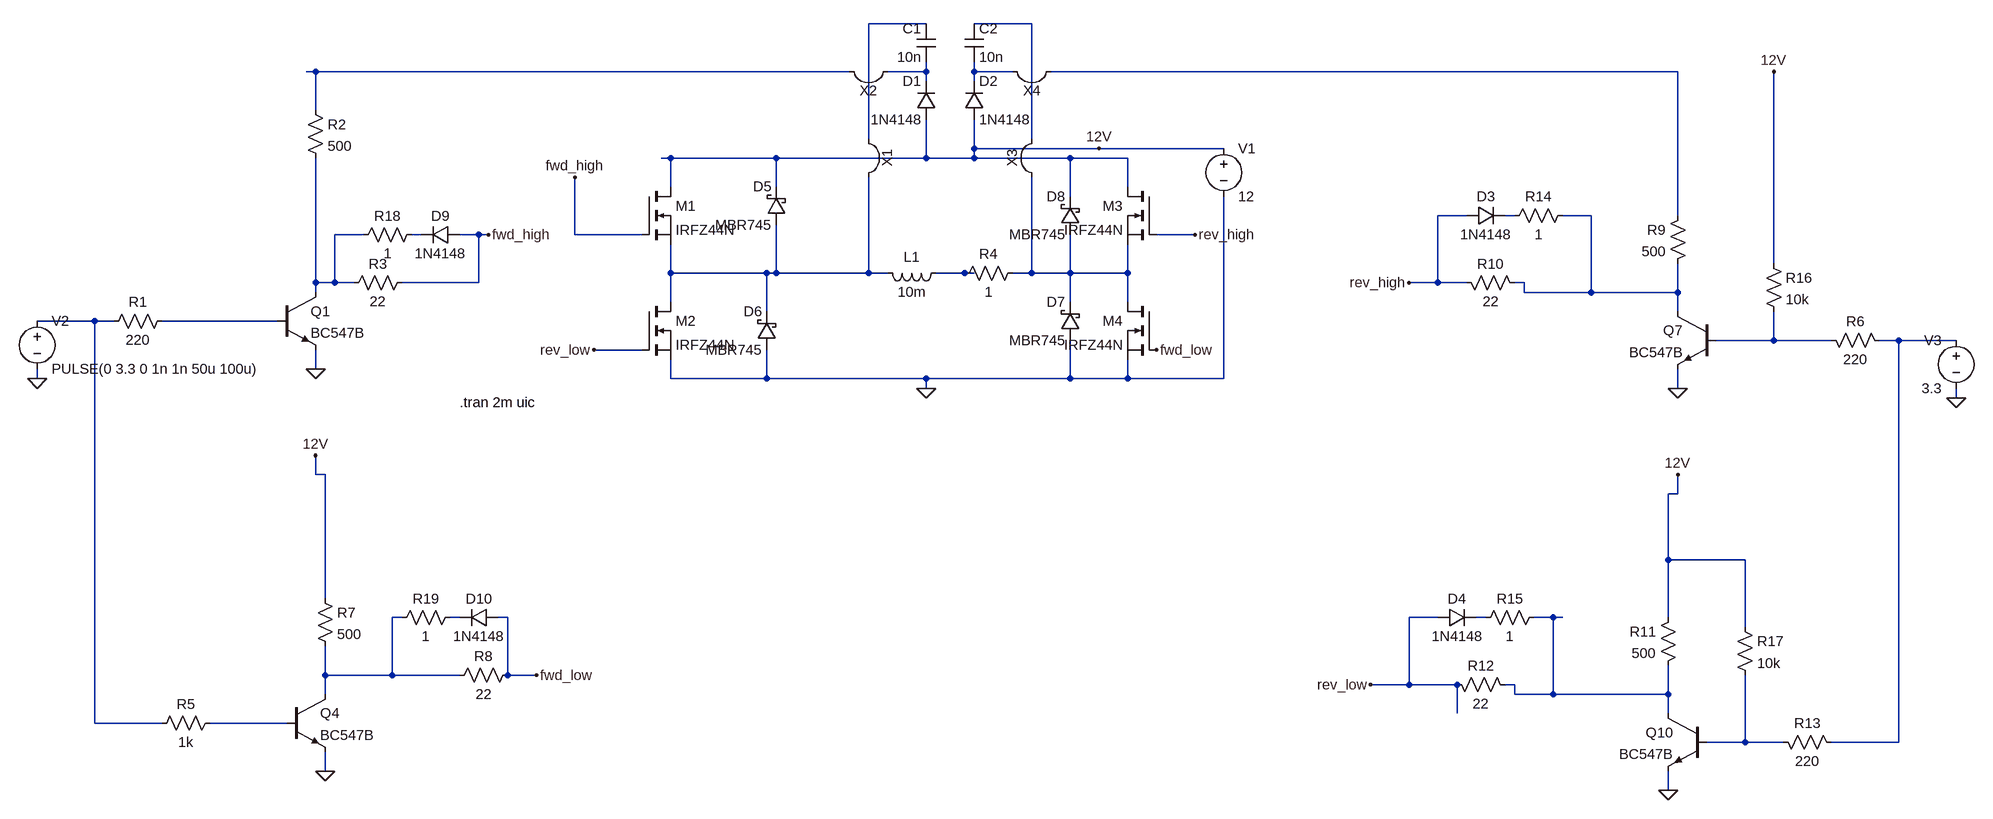
[diagram p0: schematic h-bridge-minimal.asc]
h-bridge-minimal.asc, the LTspice schematic file:
Version 4
SHEET 1 2020 1028
WIRE 224 -272 128 -272
WIRE 400 -272 304 -272
WIRE -832 -192 -848 -192
WIRE 96 -192 -832 -192
WIRE 224 -192 224 -208
WIRE 224 -192 160 -192
WIRE 304 -192 304 -208
WIRE 368 -192 304 -192
WIRE 1520 -192 432 -192
WIRE 224 -176 224 -192
WIRE 304 -176 304 -192
WIRE -832 -128 -832 -192
WIRE 128 -80 128 -272
WIRE 400 -80 400 -272
WIRE 304 -64 304 -112
WIRE 512 -64 304 -64
WIRE 720 -64 512 -64
WIRE -240 -48 -256 -48
WIRE -64 -48 -240 -48
WIRE 224 -48 224 -112
WIRE 224 -48 -64 -48
WIRE 304 -48 304 -64
WIRE 304 -48 224 -48
WIRE 464 -48 304 -48
WIRE 560 -48 464 -48
WIRE -240 0 -240 -48
WIRE -64 0 -64 -48
WIRE 560 0 560 -48
WIRE 464 16 464 -48
WIRE 1168 48 1120 48
WIRE 1248 48 1232 48
WIRE 1376 48 1328 48
WIRE 1520 48 1520 -192
WIRE -752 80 -800 80
WIRE -656 80 -672 80
WIRE -560 80 -592 80
WIRE -544 80 -560 80
WIRE -400 80 -400 -16
WIRE -288 80 -400 80
WIRE 672 80 608 80
WIRE 1680 128 1680 -192
WIRE -240 144 -240 96
WIRE -80 144 -240 144
WIRE -64 144 -64 64
WIRE -64 144 -80 144
WIRE 128 144 128 -16
WIRE 128 144 -64 144
WIRE 160 144 128 144
WIRE 288 144 240 144
WIRE 304 144 288 144
WIRE 400 144 400 -16
WIRE 400 144 368 144
WIRE 464 144 464 80
WIRE 464 144 400 144
WIRE 560 144 560 96
WIRE 560 144 464 144
WIRE -832 160 -832 -48
WIRE -800 160 -800 80
WIRE -800 160 -832 160
WIRE -768 160 -800 160
WIRE -560 160 -560 80
WIRE -560 160 -688 160
WIRE 1120 160 1120 48
WIRE 1120 160 1072 160
WIRE 1168 160 1120 160
WIRE 1264 160 1248 160
WIRE -832 176 -832 160
WIRE 1264 176 1264 160
WIRE 1376 176 1376 48
WIRE 1376 176 1264 176
WIRE 1520 176 1520 128
WIRE 1520 176 1376 176
WIRE -240 192 -240 144
WIRE 464 192 464 144
WIRE 560 192 560 144
WIRE -80 208 -80 144
WIRE 1520 208 1520 176
WIRE -1200 224 -1296 224
WIRE -1168 224 -1200 224
WIRE -896 224 -1088 224
WIRE 1680 256 1680 208
WIRE 1680 256 1584 256
WIRE 1776 256 1680 256
WIRE 1888 256 1856 256
WIRE 1984 256 1888 256
WIRE -288 272 -368 272
WIRE -832 304 -832 272
WIRE -1296 320 -1296 304
WIRE -240 320 -240 288
WIRE -80 320 -80 272
WIRE -80 320 -240 320
WIRE 224 320 -80 320
WIRE 464 320 464 256
WIRE 464 320 224 320
WIRE 560 320 560 288
WIRE 560 320 464 320
WIRE 720 320 720 16
WIRE 720 320 560 320
WIRE 224 336 224 320
WIRE 1520 336 1520 304
WIRE 1984 352 1984 336
WIRE -832 480 -832 448
WIRE -816 480 -832 480
WIRE 1520 512 1520 480
WIRE 1520 512 1504 512
WIRE 1504 624 1504 512
WIRE 1632 624 1504 624
WIRE -816 688 -816 480
WIRE -688 720 -704 720
WIRE -592 720 -608 720
WIRE -512 720 -528 720
WIRE 1120 720 1072 720
WIRE 1200 720 1184 720
WIRE 1312 720 1280 720
WIRE 1328 720 1312 720
WIRE 1504 720 1504 624
WIRE 1632 736 1632 624
WIRE -816 816 -816 768
WIRE -704 816 -704 720
WIRE -704 816 -816 816
WIRE -592 816 -704 816
WIRE -512 816 -512 720
WIRE -464 816 -512 816
WIRE 1072 832 1072 720
WIRE 1072 832 1008 832
WIRE 1152 832 1072 832
WIRE 1248 832 1232 832
WIRE -816 848 -816 816
WIRE 1248 848 1248 832
WIRE 1312 848 1312 720
WIRE 1312 848 1248 848
WIRE 1504 848 1504 800
WIRE 1504 848 1312 848
WIRE 1152 880 1152 832
WIRE 1504 880 1504 848
WIRE -1200 896 -1200 224
WIRE -1088 896 -1200 896
WIRE -880 896 -1008 896
WIRE 1632 928 1632 816
WIRE 1632 928 1568 928
WIRE 1696 928 1632 928
WIRE 1888 928 1888 256
WIRE 1888 928 1776 928
WIRE -816 976 -816 944
WIRE 1504 1008 1504 976
FLAG 224 336 0
FLAG -1296 320 0
FLAG -832 304 0
FLAG 608 272 fwd_low
FLAG -816 976 0
FLAG -464 816 fwd_low
FLAG 512 -64 12V
FLAG -832 448 12V
FLAG 1984 352 0
FLAG 1520 336 0
FLAG 1504 1008 0
FLAG 1008 832 rev_low
FLAG 1520 480 12V
FLAG 1072 160 rev_high
FLAG 672 80 rev_high
FLAG -368 272 rev_low
FLAG -544 80 fwd_high
FLAG -400 -16 fwd_high
FLAG 1680 -192 12V
SYMBOL nmos -288 0 R0
SYMATTR InstName M1
SYMATTR Value IRFZ44N
SYMBOL nmos -288 192 R0
SYMATTR InstName M2
SYMATTR Value IRFZ44N
SYMBOL nmos 608 0 M0
SYMATTR InstName M3
SYMATTR Value IRFZ44N
SYMBOL nmos 608 192 M0
SYMATTR InstName M4
SYMATTR Value IRFZ44N
SYMBOL voltage 720 -80 R0
WINDOW 123 0 0 Left 0
WINDOW 39 0 0 Left 0
SYMATTR InstName V1
SYMATTR Value 12
SYMBOL voltage -1296 208 R0
WINDOW 123 0 0 Left 0
WINDOW 39 0 0 Left 0
SYMATTR InstName V2
SYMATTR Value PULSE(0 3.3 0 1n 1n 50u 100u)
SYMBOL res -1072 208 R90
WINDOW 0 0 56 VBottom 2
WINDOW 3 32 56 VTop 2
SYMATTR InstName R1
SYMATTR Value 220
SYMBOL npn -896 176 R0
SYMATTR InstName Q1
SYMATTR Value BC547B
SYMBOL res -848 -144 R0
SYMATTR InstName R2
SYMATTR Value 500
SYMBOL diode 240 -112 R180
WINDOW 0 24 64 Left 2
WINDOW 3 24 0 Left 2
SYMATTR InstName D1
SYMATTR Value 1N4148
SYMBOL cap 240 -208 R180
WINDOW 0 24 56 Left 2
WINDOW 3 24 8 Left 2
SYMATTR InstName C1
SYMATTR Value 10n
SYMBOL Misc\\jumper 192 -48 R90
SYMATTR InstName X1
SYMBOL Misc\\jumper 128 -128 R180
SYMATTR InstName X2
SYMBOL res -672 144 R90
WINDOW 0 0 56 VBottom 2
WINDOW 3 32 56 VTop 2
SYMATTR InstName R3
SYMATTR Value 22
SYMBOL res 384 128 R90
WINDOW 0 0 56 VBottom 2
WINDOW 3 32 56 VTop 2
SYMATTR InstName R4
SYMATTR Value 1
SYMBOL npn -880 848 R0
SYMATTR InstName Q4
SYMATTR Value BC547B
SYMBOL res -832 672 R0
SYMATTR InstName R7
SYMATTR Value 500
SYMBOL res -496 800 R90
WINDOW 0 0 56 VBottom 2
WINDOW 3 32 56 VTop 2
SYMATTR InstName R8
SYMATTR Value 22
SYMBOL res -992 880 R90
WINDOW 0 0 56 VBottom 2
WINDOW 3 32 56 VTop 2
SYMATTR InstName R5
SYMATTR Value 1k
SYMBOL voltage 1984 240 M0
WINDOW 123 0 0 Left 0
WINDOW 39 0 0 Left 0
SYMATTR InstName V3
SYMATTR Value 3.3
SYMBOL res 1760 240 M90
WINDOW 0 0 56 VBottom 2
WINDOW 3 32 56 VTop 2
SYMATTR InstName R6
SYMATTR Value 220
SYMBOL npn 1584 208 M0
SYMATTR InstName Q7
SYMATTR Value BC547B
SYMBOL res 1536 32 M0
SYMATTR InstName R9
SYMATTR Value 500
SYMBOL res 1152 144 M90
WINDOW 0 0 56 VBottom 2
WINDOW 3 32 56 VTop 2
SYMATTR InstName R10
SYMATTR Value 22
SYMBOL npn 1568 880 M0
SYMATTR InstName Q10
SYMATTR Value BC547B
SYMBOL res 1520 704 M0
SYMATTR InstName R11
SYMATTR Value 500
SYMBOL res 1136 816 M90
WINDOW 0 0 56 VBottom 2
WINDOW 3 32 56 VTop 2
SYMATTR InstName R12
SYMATTR Value 22
SYMBOL res 1680 912 M90
WINDOW 0 0 56 VBottom 2
WINDOW 3 32 56 VTop 2
SYMATTR InstName R13
SYMATTR Value 220
SYMBOL diode 288 -112 M180
WINDOW 0 24 64 Left 2
WINDOW 3 24 0 Left 2
SYMATTR InstName D2
SYMATTR Value 1N4148
SYMBOL cap 288 -208 M180
WINDOW 0 24 56 Left 2
WINDOW 3 24 8 Left 2
SYMATTR InstName C2
SYMATTR Value 10n
SYMBOL Misc\\jumper 336 -48 M90
SYMATTR InstName X3
SYMBOL Misc\\jumper 400 -128 M180
SYMATTR InstName X4
SYMBOL ind 256 128 R90
WINDOW 0 5 56 VBottom 2
WINDOW 3 32 56 VTop 2
SYMATTR InstName L1
SYMATTR Value 10m
SYMBOL res 1664 112 R0
SYMATTR InstName R16
SYMATTR Value 10k
SYMBOL res 1616 720 R0
SYMATTR InstName R17
SYMATTR Value 10k
SYMBOL diode 1168 64 R270
WINDOW 0 32 32 VTop 2
WINDOW 3 0 32 VBottom 2
SYMATTR InstName D3
SYMATTR Value 1N4148
SYMBOL res 1344 32 R90
WINDOW 0 0 56 VBottom 2
WINDOW 3 32 56 VTop 2
SYMATTR InstName R14
SYMATTR Value 1
SYMBOL diode 1120 736 R270
WINDOW 0 32 32 VTop 2
WINDOW 3 0 32 VBottom 2
SYMATTR InstName D4
SYMATTR Value 1N4148
SYMBOL res 1296 704 R90
WINDOW 0 0 56 VBottom 2
WINDOW 3 32 56 VTop 2
SYMATTR InstName R15
SYMATTR Value 1
SYMBOL schottky -48 64 R180
WINDOW 0 24 64 Left 2
WINDOW 3 24 0 Left 2
SYMATTR InstName D5
SYMATTR Value MBR745
SYMATTR Description Diode
SYMATTR Type diode
SYMBOL schottky -64 272 R180
WINDOW 0 24 64 Left 2
WINDOW 3 24 0 Left 2
SYMATTR InstName D6
SYMATTR Value MBR745
SYMATTR Description Diode
SYMATTR Type diode
SYMBOL schottky 480 256 R180
WINDOW 0 24 64 Left 2
WINDOW 3 24 0 Left 2
SYMATTR InstName D7
SYMATTR Value MBR745
SYMATTR Description Diode
SYMATTR Type diode
SYMBOL schottky 480 80 R180
WINDOW 0 24 64 Left 2
WINDOW 3 24 0 Left 2
SYMATTR InstName D8
SYMATTR Value MBR745
SYMATTR Description Diode
SYMATTR Type diode
SYMBOL diode -592 64 R90
WINDOW 0 0 32 VBottom 2
WINDOW 3 32 32 VTop 2
SYMATTR InstName D9
SYMATTR Value 1N4148
SYMBOL res -768 96 R270
WINDOW 0 32 56 VTop 2
WINDOW 3 0 56 VBottom 2
SYMATTR InstName R18
SYMATTR Value 1
SYMBOL diode -528 704 R90
WINDOW 0 0 32 VBottom 2
WINDOW 3 32 32 VTop 2
SYMATTR InstName D10
SYMATTR Value 1N4148
SYMBOL res -704 736 R270
WINDOW 0 32 56 VTop 2
WINDOW 3 0 56 VBottom 2
SYMATTR InstName R19
SYMATTR Value 1
TEXT -592 360 Left 2 !.tran 2m uic

The netlist it stands for:
* h-bridge-minimal.asc
M1 12V fwd_high N001 N001 IRFZ44N
M2 N001 rev_low 0 0 IRFZ44N
M3 12V rev_high N002 N002 IRFZ44N
M4 N002 fwd_low 0 0 IRFZ44N
V1 12V 0 12
V2 N010 0 PULSE(0 3.3 0 1n 1n 50u 100u)
R1 N011 N010 220
Q1 N007 N011 0 0 BC547B
R2 N003 N007 500
D1 12V N003 1N4148
C1 N003 N001 10n
R3 fwd_high N007 22
R4 N002 N009 1
Q4 N014 N018 0 0 BC547B
R7 12V N014 500
R8 fwd_low N014 22
R5 N018 N010 1k
V3 N013 0 3.3
R6 N012 N013 220
Q7 N006 N012 0 0 BC547B
R9 N004 N006 500
R10 rev_high N006 22
Q10 N017 N019 0 0 BC547B
R11 12V N017 500
R12 rev_low N017 22
R13 N019 N013 220
D2 12V N004 1N4148
C2 N004 N002 10n
L1 N009 N001 10m
R16 12V N012 10k
R17 12V N019 10k
D3 rev_high N005 1N4148
R14 N006 N005 1
D4 rev_low N016 1N4148
R15 N017 N016 1
D5 N001 12V MBR745
D6 0 N001 MBR745
D7 0 N002 MBR745
D8 N002 12V MBR745
D9 fwd_high N008 1N4148
R18 N007 N008 1
D10 fwd_low N015 1N4148
R19 N014 N015 1
.model D D
.lib standard.dio
.model NPN NPN
.model PNP PNP
.lib standard.bjt
.model NMOS NMOS
.model PMOS PMOS
.lib standard.mos
.tran 2m uic
.backanno
.end